# EAGLE schematic TapTempo (EAGLE 6.6.0)
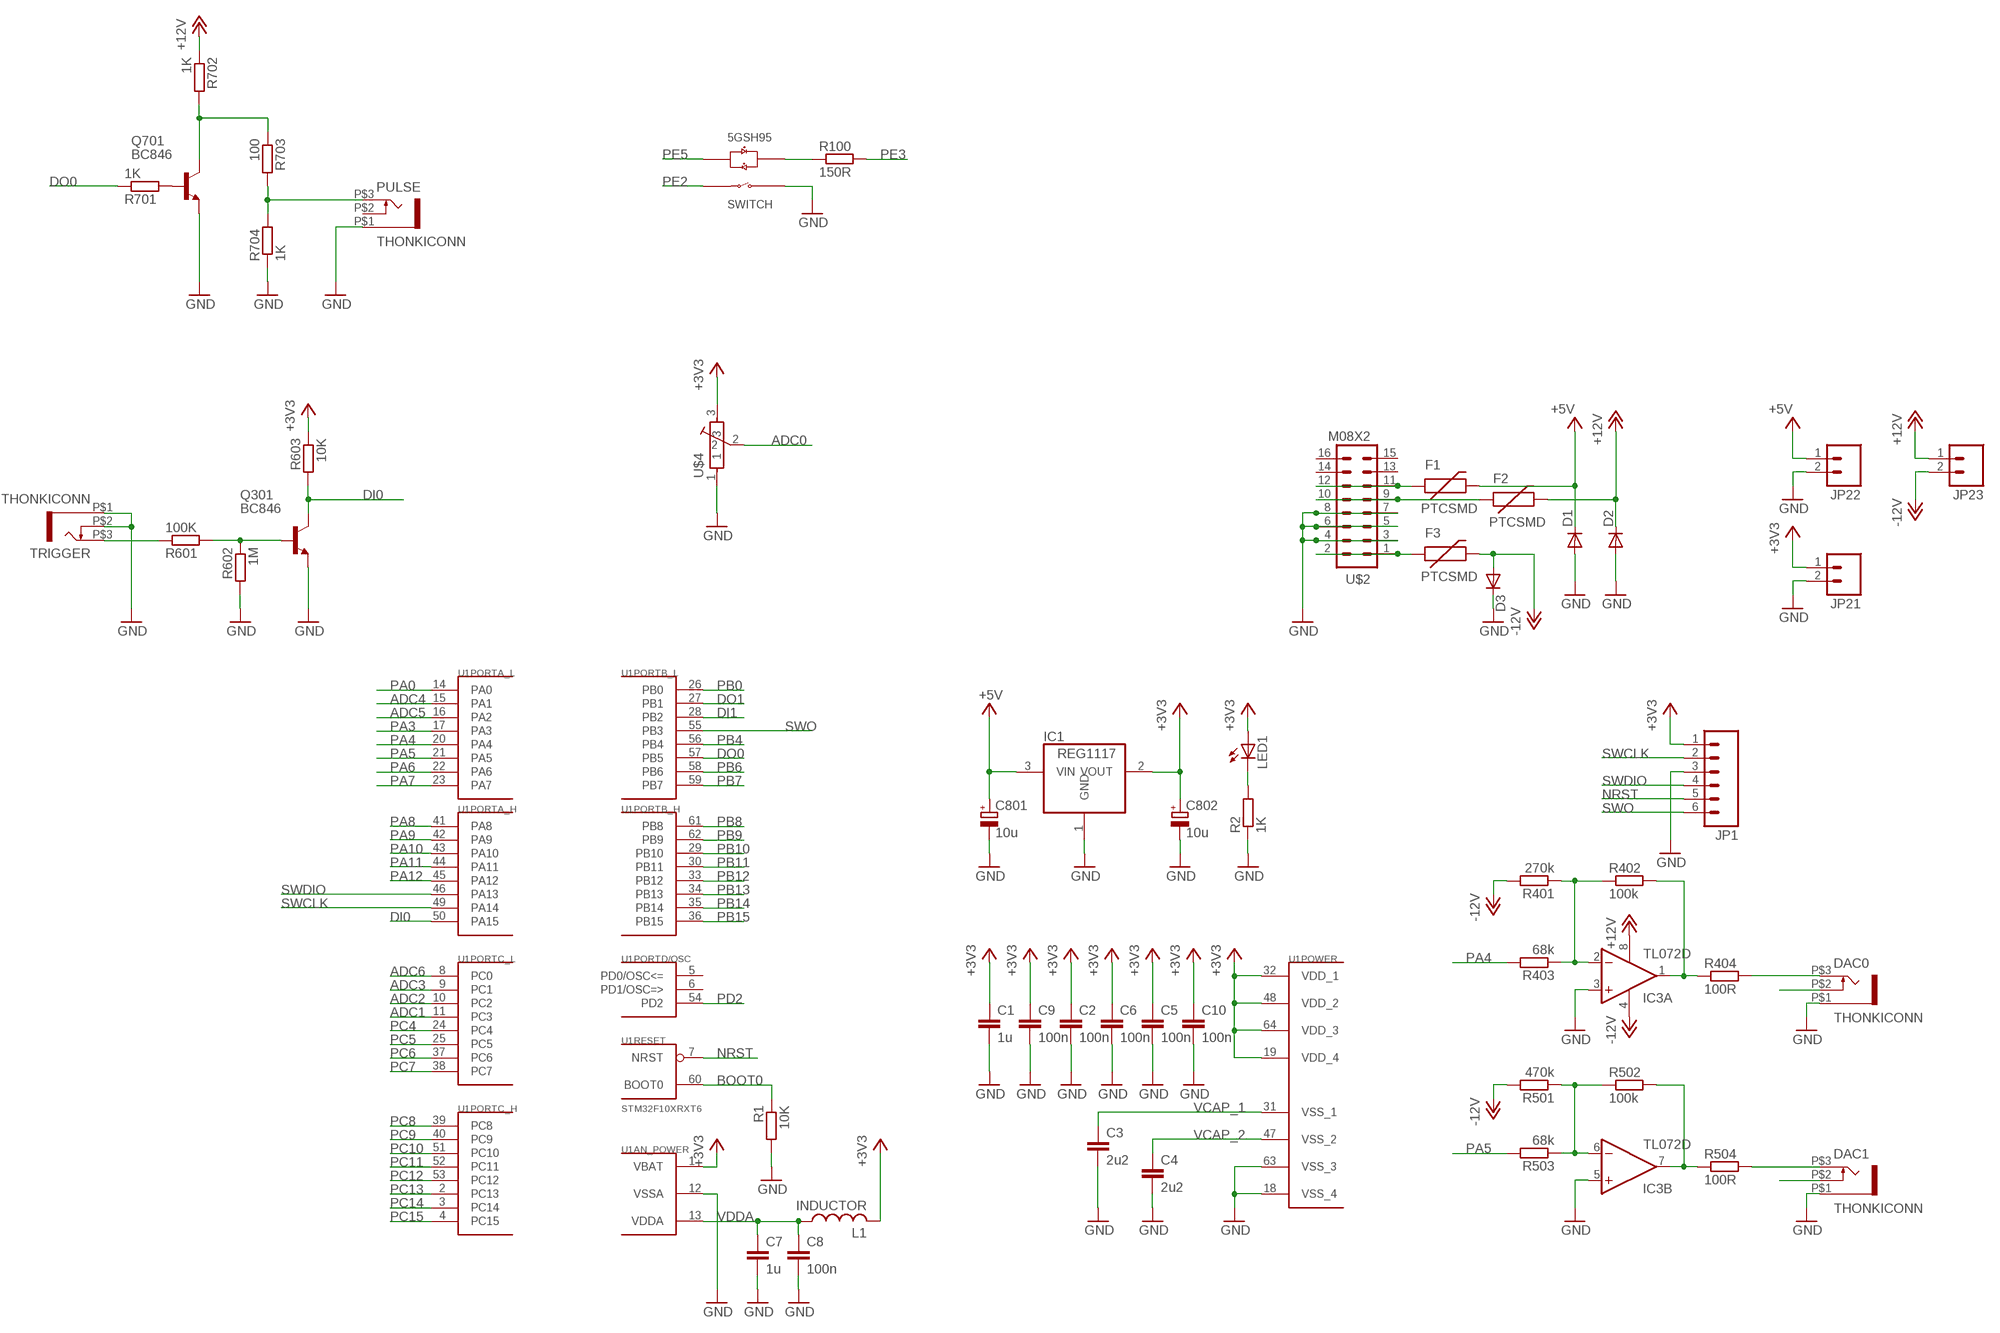
[diagram p0: schematic, sheet 1]

## Parts
C1  1u  C-EUC0603  [C0603]
C2  100n  C-EUC0603  [C0603]
C3  2u2  C-EUC0603  [C0603]
C4  2u2  C-EUC0603  [C0603]
C5  100n  C-EUC0603  [C0603]
C6  100n  C-EUC0603  [C0603]
C7  1u  C-EUC0603  [C0603]
C8  100n  C-EUC0603  [C0603]
C9  100n  C-EUC0603  [C0603]
C10  100n  C-EUC0603  [C0603]
C801  10u  CPOL-EUA  [PANASONIC_A]
C802  10u  CPOL-EUA  [PANASONIC_A]
D1  DIODESMA  [SMA-DIODE]
D2  DIODESMA  [SMA-DIODE]
D3  DIODESMA  [SMA-DIODE]
DAC0  THONKICONN  [THONKICONN]
DAC1  THONKICONN  [THONKICONN]
F1  PTCSMD  [PTC-1206]
F2  PTCSMD  [PTC-1206]
F3  PTCSMD  [PTC-1206]
IC1  REG1117  [SOT223]
IC3  TL072D  [SO08]
JP1  M06SIP  [1X06]
JP21  M02PTH  [1X02]
JP22  M02PTH  [1X02]
JP23  M02PTH  [1X02]
L1  INDUCTOR  [0603@1]
LED1  LEDCHIPLED_0603  [CHIPLED_0603]
PULSE  THONKICONN  [THONKICONN]
Q301  BC846  [SOT23]
Q701  BC846  [SOT23]
R1  10K  R-EU_R0603  [R0603]
R2  1K  R-EU_R0603  [R0603]
R100  150R  R-EU_0603  [0603]
R401  270k  R-EU_R0603  [R0603]
R402  100k  R-EU_R0603  [R0603]
R403  68k  R-EU_R0603  [R0603]
R404  100R  R-EU_R0603  [R0603]
R501  470k  R-EU_R0603  [R0603]
R502  100k  R-EU_R0603  [R0603]
R503  68k  R-EU_R0603  [R0603]
R504  100R  R-EU_R0603  [R0603]
R601  100K  R-EU_R0603  [R0603]
R602  1M  R-EU_R0603  [R0603]
R603  10K  R-EU_R0603  [R0603]
R701  1K  R-EU_R0603  [R0603]
R702  1K  R-EU_R0603  [R0603]
R703  100  R-EU_R0603  [R0603]
R704  1K  R-EU_R0603  [R0603]
TRIGGER  THONKICONN  [THONKICONN]
U1  STM32F10XRXT6  [TQFP64]
U$1  5GTH9  [5GTH9]
U$2  M08X2  [2X8]
U$4  POT-ALPS-RK09L1140  [POT-ALPS-RK09L1140]

## Nets
+3V3: C1.1 C2.1 C5.1 C6.1 C9.1 C10.1 C802.+ IC1.2(VOUT) JP1.1 JP21.1 L1.2 LED1.A R603.1 U1.1(AN_POWER:VBAT) U1.19(POWER:VDD_4) U1.32(POWER:VDD_1) U1.48(POWER:VDD_2) U1.64(POWER:VDD_3) U$4.3
+5V: C801.+ D1.C F1.2 IC1.3(VIN) JP22.1
+12V: D2.C F2.2 IC3.8(P:V+) JP23.1 R702.1
-12V: D3.A F3.2 IC3.4(P:V-) JP23.2 R401.2 R501.2
ADC0: U$4.2
ADC1: U1.11(PORTC_L:PC3)
ADC2: U1.10(PORTC_L:PC2)
ADC3: U1.9(PORTC_L:PC1)
ADC4: U1.15(PORTA_L:PA1)
ADC5: U1.16(PORTA_L:PA2)
ADC6: U1.8(PORTC_L:PC0)
BOOT0: R1.1 U1.60(RESET:BOOT0)
DI0: Q301.3(C) R603.2 U1.50(PORTA_H:PA15)
DI1: U1.28(PORTB_L:PB2)
DO0: R701.1 U1.57(PORTB_L:PB5)
DO1: U1.27(PORTB_L:PB1)
GND: C1.2 C2.2 C3.2 C4.2 C5.2 C6.2 C7.2 C8.2 C9.2 C10.2 C801.- C802.- D1.A D2.A D3.C DAC0.P$1 DAC1.P$1 IC1.1(GND) IC3.3(A:+IN) IC3.5(B:+IN) JP1.3 JP21.2 JP22.2 PULSE.P$1 Q301.2(E) Q701.2(E) R1.2 R2.1 R602.2 R704.1 TRIGGER.P$1 TRIGGER.P$2 U1.12(AN_POWER:VSSA) U1.18(POWER:VSS_4) U1.63(POWER:VSS_3) U$1.1(SWITCH_B) U$2.3 U$2.4 U$2.5 U$2.6 U$2.7 U$2.8 U$4.1
N$5: IC3.7(B:OUT) R502.2 R504.1
N$6: F3.1 U$2.1 U$2.2
N$7: IC3.1(A:OUT) R402.2 R404.1
N$8: DAC0.P$2
N$10: R100.1 U$1.+3(LED_R+)
N$13: IC3.2(A:-IN) R401.1 R402.1 R403.1
N$18: IC3.6(B:-IN) R501.1 R502.1 R503.1
N$19: LED1.C R2.2
N$23: R601.1 TRIGGER.P$3
N$27: Q301.1(B) R601.2 R602.1
N$29: DAC1.P$2
N$31: DAC0.P$3 R404.2
N$32: DAC1.P$3 R504.2
N$34: Q701.1(B) R701.2
N$35: PULSE.P$3 R703.2 R704.2
N$38: Q701.3(C) R702.2 R703.1
N$44: F1.1 U$2.11 U$2.12
N$45: F2.1 U$2.9 U$2.10
NRST: JP1.5 U1.7(RESET:NRST)
PA0: U1.14(PORTA_L:PA0)
PA3: U1.17(PORTA_L:PA3)
PA4: R403.2 U1.20(PORTA_L:PA4)
PA5: R503.2 U1.21(PORTA_L:PA5)
PA6: U1.22(PORTA_L:PA6)
PA7: U1.23(PORTA_L:PA7)
PA8: U1.41(PORTA_H:PA8)
PA9: U1.42(PORTA_H:PA9)
PA10: U1.43(PORTA_H:PA10)
PA11: U1.44(PORTA_H:PA11)
PA12: U1.45(PORTA_H:PA12)
PB0: U1.26(PORTB_L:PB0)
PB4: U1.56(PORTB_L:PB4)
PB6: U1.58(PORTB_L:PB6)
PB7: U1.59(PORTB_L:PB7)
PB8: U1.61(PORTB_H:PB8)
PB9: U1.62(PORTB_H:PB9)
PB10: U1.29(PORTB_H:PB10)
PB11: U1.30(PORTB_H:PB11)
PB12: U1.33(PORTB_H:PB12)
PB13: U1.34(PORTB_H:PB13)
PB14: U1.35(PORTB_H:PB14)
PB15: U1.36(PORTB_H:PB15)
PC4: U1.24(PORTC_L:PC4)
PC5: U1.25(PORTC_L:PC5)
PC6: U1.37(PORTC_L:PC6)
PC7: U1.38(PORTC_L:PC7)
PC8: U1.39(PORTC_H:PC8)
PC9: U1.40(PORTC_H:PC9)
PC10: U1.51(PORTC_H:PC10)
PC11: U1.52(PORTC_H:PC11)
PC12: U1.53(PORTC_H:PC12)
PC13: U1.2(PORTC_H:PC13)
PC14: U1.3(PORTC_H:PC14)
PC15: U1.4(PORTC_H:PC15)
PD2: U1.54(PORTD/OSC:PD2)
PE2: U$1.4(SWITCH_A)
PE3: R100.2
PE5: U$1.-2(LED_G+)
SWCLK: JP1.2 U1.49(PORTA_H:PA14)
SWDIO: JP1.4 U1.46(PORTA_H:PA13)
SWO: JP1.6 U1.55(PORTB_L:PB3)
VCAP_1: C3.1 U1.31(POWER:VSS_1)
VCAP_2: C4.1 U1.47(POWER:VSS_2)
VDDA: C7.1 C8.1 L1.1 U1.13(AN_POWER:VDDA)
Unconnected: PULSE.P$2 U1.5(PORTD/OSC:PD0/OSC<=) U1.6(PORTD/OSC:PD1/OSC=>) U$2.13 U$2.14 U$2.15 U$2.16 U$4.P$5 U$4.P$6

## Library data of the parts
C1-C10 = resistor:C-EU: CAPACITOR, European symbol
C801 C802 = resistor:CPOL-EU: POLARIZED CAPACITOR, European symbol
D1-D3 = SparkFun:DIODE: Diode These are standard reverse protection diodes and small signal diodes. SMA package can handle up to about 1A. SOD-323 can handle about 200mA. What the SOD-323 package when ordering, there are some mfgs out there that are 5-pin packages.
DAC0 DAC1 PULSE TRIGGER = Rebel:THONKICONN
F1-F3 = SparkFun:PTC: Resettable Fuse PTC Resettable Fuse. Spark Fun Electronics SKU : COM-08357
IC1 = burr-brown:REG1117: 800mA and 1A Low Dropout (LDO) Positive Regulator 1.8V, 2.5V, 2.85V, 3.3V, 5V, and Adj; MPN: REG1117; OC_FARNELL: 1097566; OC_NEWARK: 14P6981
IC3 = linear:TL072: OP AMP
JP1 = SparkFun:M06: Header 6 Standard 6-pin 0.1" header. Use with straight break away headers (SKU : PRT-00116), right angle break away headers (PRT-00553), swiss pins (PRT-00743), machine pins (PRT-00117), and female headers (PRT-00115). Molex polarized connector foot print use with SKU : PRT-08094 with associated crimp pins and housings. NOTES ON THE VARIANTS LOCK and LOCK_LONGPADS... This footprint was designed to help hold the alignment of a through-hole component (i.e. 6-pin header) while soldering it into place. You may notice that each hole has been shifted either up or down by 0.005 of an inch from it's more standard position (which is a perfectly straight line). This slight alteration caused the pins (the squares in the middle) to touch the edges of the holes. Because they are alternating, it causes a "brace" to hold the component in place. 0.005 has proven to be the perfect amount of "off-center" position when using our standard breakaway headers. Although looks a little odd when you look at the bare footprint, once you have a header in there, the alteration is very hard to notice. Also, if you push a header all the way into place, it is covered up entirely on the bottom side. This idea of altering the position of holes to aid alignment will be further integrated into the Sparkfun Library for other footprints. It can help hold any component with 3 or more connection pins.
JP21-JP23 = SparkFun:M02: Header 2 Standard 2-pin 0.1" header. Use with straight break away headers (SKU : PRT-00116), right angle break away headers (PRT-00553), swiss pins (PRT-00743), machine pins (PRT-00117), and female headers (PRT-00115). Molex polarized connector foot print use with SKU : PRT-08233 with associated crimp pins and housings.
L1 = Rebel:INDUCTOR
LED1 = led:LED: LED OSRAM: - CHIPLED LG R971, LG N971, LY N971, LG Q971, LY Q971, LO R971, LY R971 LH N974, LH R974 LS Q976, LO Q976, LY Q976 LO Q996 - Hyper CHIPLED LW Q18S LB Q993, LB Q99A, LB R99A - SideLED LS A670, LO A670, LY A670, LG A670, LP A670 LB A673, LV A673, LT A673, LW A673 LH A674 LY A675 LS A676, LA A676, LO A676, LY A676, LW A676 LS A679, LY A679, LG A679 - Hyper Micro SIDELED® LS Y876, LA Y876, LO Y876, LY Y876 LT Y87S - SmartLED LW L88C, LW L88S LB L89C, LB L89S, LG L890 LS L89K, LO L89K, LY L89K LS L896, LA L896, LO L896, LY L896 - TOPLED LS T670, LO T670, LY T670, LG T670, LP T670 LSG T670, LSP T670, LSY T670, LOP T670, LYG T670 LG T671, LOG T671, LSG T671 LB T673, LV T673, LT T673, LW T673 LH T674 LS T676, LA T676, LO T676, LY T676, LB T676, LH T676, LSB T676, LW T676 LB T67C, LV T67C, LT T67C, LS T67K, LO T67K, LY T67K, LW E67C LS E67B, LA E67B, LO E67B, LY E67B, LB E67C, LV E67C, LT E67C LW T67C LS T679, LY T679, LG T679 LS T770, LO T770, LY T770, LG T770, LP T770 LB T773, LV T773, LT T773, LW T773 LH T774 LS E675, LA E675, LY E675, LS T675 LS T776, LA T776, LO T776, LY T776, LB T776 LHGB T686 LT T68C, LB T68C - Hyper Mini TOPLED® LB M676 - Mini TOPLED Santana® LG M470 LS M47K, LO M47K, LY M47K Source: http://www.osram.convergy.de LUXEON: - LUMILED® LXK2-PW12-R00, LXK2-PW12-S00, LXK2-PW14-U00, LXK2-PW14-V00 LXK2-PM12-R00, LXK2-PM12-S00, LXK2-PM14-U00 LXK2-PE12-Q00, LXK2-PE12-R00, LXK2-PE12-S00, LXK2-PE14-T00, LXK2-PE14-U00 LXK2-PB12-K00, LXK2-PB12-L00, LXK2-PB12-M00, LXK2-PB14-N00, LXK2-PB14-P00, LXK2-PB14-Q00 LXK2-PR12-L00, LXK2-PR12-M00, LXK2-PR14-Q00, LXK2-PR14-R00 LXK2-PD12-Q00, LXK2-PD12-R00, LXK2-PD12-S00 LXK2-PH12-R00, LXK2-PH12-S00 LXK2-PL12-P00, LXK2-PL12-Q00, LXK2-PL12-R00 Source: www.luxeon.com KINGBRIGHT: KA-3528ASYC Source: www.kingbright.com
Q301 Q701 = transistor:BC846: NPN TRANSISTOR
R1 R2 R401-R404 R501-R504 R601-R603 R701-R704 = resistor:R-EU_: RESISTOR, European symbol
R100 = Rebel:R-EU_: RESISTOR, European symbol
U1 = stm32:STM32F10XRXT6: STM32F101/103 64pin LQFP
U$1 = SWITCH-5GTH9:5GTH9
U$2 = SparkFun:M08X2
U$4 = Rebel:POT-ALPS-RK09L